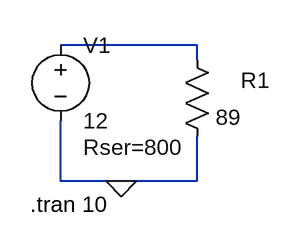
[diagram p0: schematic Draft1.asc]
Draft1.asc, the LTspice schematic file:
Version 4
SHEET 1 880 680
WIRE 128 0 -16 0
WIRE 128 16 128 0
WIRE -16 144 -16 80
WIRE 48 144 -16 144
WIRE 128 144 128 96
WIRE 128 144 48 144
FLAG 48 144 0
SYMBOL voltage -16 -16 R0
WINDOW 123 0 0 Left 0
WINDOW 39 24 124 Left 2
SYMATTR SpiceLine Rser=800
SYMATTR InstName V1
SYMATTR Value 12
SYMBOL res 112 0 R0
WINDOW 0 62 37 Left 2
SYMATTR InstName R1
SYMATTR Value 89
TEXT -48 168 Left 2 !.tran 10

The netlist it stands for:
* Draft1.asc
V1 N001 0 12 Rser=800
R1 N001 0 89
.tran 10
.backanno
.end